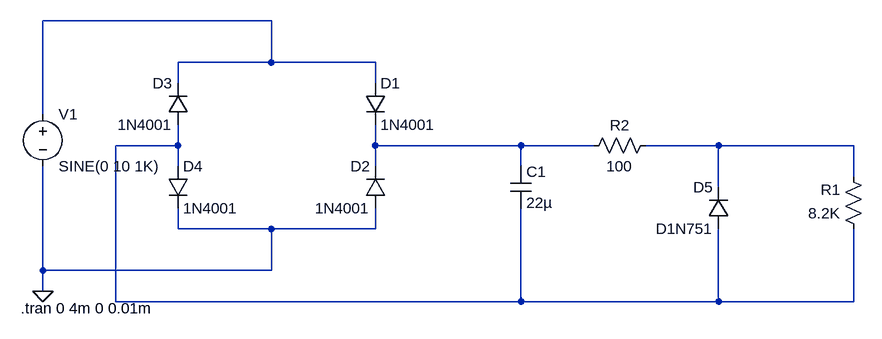
[diagram p0: schematic acdcconv_02_03_03_set_load_8.2k_iz_vl.asc]
acdcconv_02_03_03_set_load_8.2k_iz_vl.asc, the LTspice schematic file:
Version 4
SHEET 1 1308 680
WIRE 272 32 -80 32
WIRE 272 96 272 32
WIRE 272 96 128 96
WIRE 432 96 272 96
WIRE 128 128 128 96
WIRE 432 128 432 96
WIRE -80 176 -80 32
WIRE 128 224 128 192
WIRE 128 224 32 224
WIRE 432 224 432 192
WIRE 656 224 432 224
WIRE 768 224 656 224
WIRE 960 224 848 224
WIRE 1168 224 960 224
WIRE 128 256 128 224
WIRE 432 256 432 224
WIRE 656 256 656 224
WIRE 1168 272 1168 224
WIRE 960 288 960 224
WIRE 128 352 128 320
WIRE 272 352 128 352
WIRE 432 352 432 320
WIRE 432 352 272 352
WIRE -80 416 -80 256
WIRE 272 416 272 352
WIRE 272 416 -80 416
WIRE -80 448 -80 416
WIRE 32 464 32 224
WIRE 656 464 656 320
WIRE 656 464 32 464
WIRE 960 464 960 352
WIRE 960 464 656 464
WIRE 1168 464 1168 352
WIRE 1168 464 960 464
FLAG -80 448 0
SYMBOL diode 416 128 R0
SYMATTR InstName D1
SYMATTR Value 1N4001
SYMBOL diode 448 320 R180
WINDOW 0 24 64 Left 2
WINDOW 3 24 0 Left 2
SYMATTR InstName D2
SYMATTR Value 1N4001
SYMBOL diode 144 192 R180
WINDOW 0 24 64 Left 2
WINDOW 3 24 0 Left 2
SYMATTR InstName D3
SYMATTR Value 1N4001
SYMBOL diode 112 256 R0
SYMATTR InstName D4
SYMATTR Value 1N4001
SYMBOL res 1184 368 R180
WINDOW 0 36 76 Left 2
WINDOW 3 36 40 Left 2
SYMATTR InstName R1
SYMATTR Value 8.2K
SYMBOL voltage -80 160 R0
WINDOW 123 0 0 Left 2
WINDOW 39 0 0 Left 2
SYMATTR InstName V1
SYMATTR Value SINE(0 10 1K)
SYMBOL cap 640 256 R0
SYMATTR InstName C1
SYMATTR Value 22µ
SYMBOL diode 976 352 R180
WINDOW 0 24 64 Left 2
WINDOW 3 24 0 Left 2
SYMATTR InstName D5
SYMATTR Value D1N751
SYMBOL res 752 240 R270
WINDOW 0 32 56 VTop 2
WINDOW 3 0 56 VBottom 2
SYMATTR InstName R2
SYMATTR Value 100
TEXT -114 474 Left 2 !.tran 0 4m 0 0.01m

The netlist it stands for:
* acdcconv_02_03_03_set_load_8.2k_iz_vl.asc
D1 N001 N003 1N4001
D2 0 N003 1N4001
D3 N002 N001 1N4001
D4 N002 0 1N4001
R1 N002 N004 8.2K
V1 N001 0 SINE(0 10 1K)
C1 N003 N002 22µ
D5 N002 N004 D1N751
R2 N003 N004 100
.model D D
.lib standard.dio
.tran 0 4m 0 0.01m
.backanno
.end